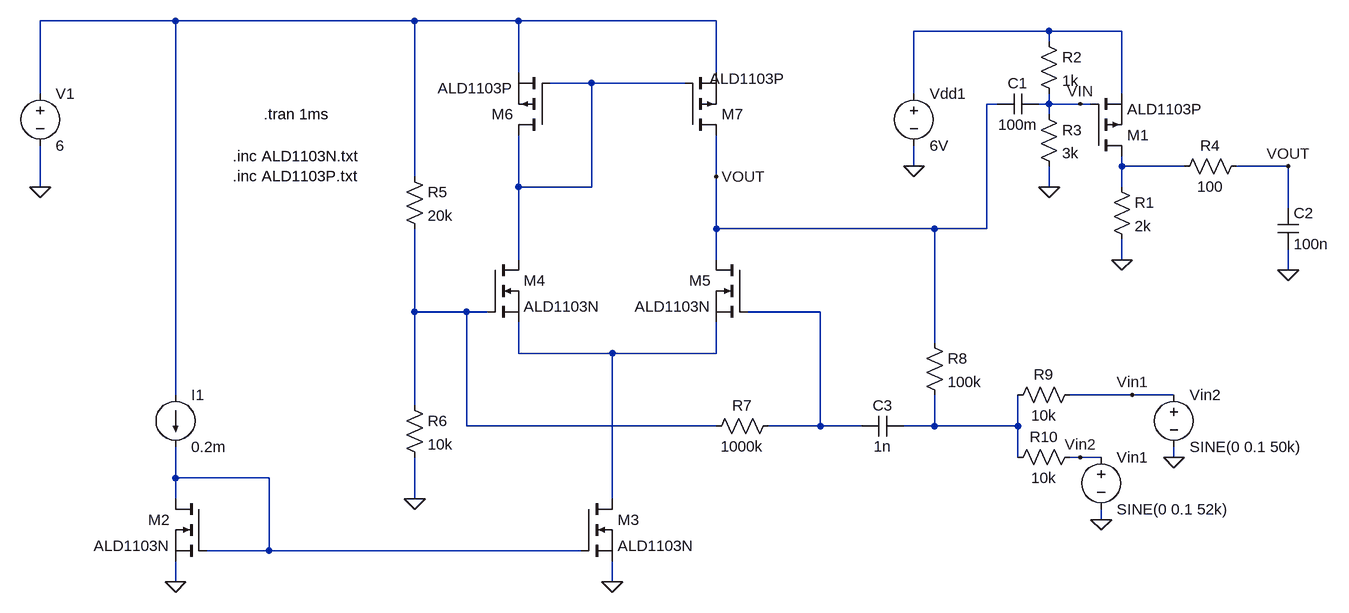
[diagram p0: schematic Draft4.asc]
Draft4.asc, the LTspice schematic file:
Version 4.1
SHEET 1 880 756
WIRE -1200 -128 -1408 -128
WIRE -832 -128 -1200 -128
WIRE -672 -128 -832 -128
WIRE -368 -128 -672 -128
WIRE 144 -112 -64 -112
WIRE 256 -112 144 -112
WIRE 144 -96 144 -112
WIRE -672 -48 -672 -128
WIRE -368 -48 -368 -128
WIRE -560 -32 -624 -32
WIRE -416 -32 -560 -32
WIRE -1408 -16 -1408 -128
WIRE -64 -16 -64 -112
WIRE 256 -16 256 -112
WIRE 64 0 48 0
WIRE 144 0 144 -16
WIRE 144 0 128 0
WIRE 192 0 144 0
WIRE 208 0 192 0
WIRE 144 16 144 0
WIRE -64 96 -64 64
WIRE 256 96 256 80
WIRE 352 96 256 96
WIRE 512 96 432 96
WIRE -832 112 -832 -128
WIRE -368 112 -368 48
WIRE -1408 128 -1408 64
WIRE -672 128 -672 48
WIRE -560 128 -560 -32
WIRE -560 128 -672 128
WIRE 144 128 144 96
WIRE 256 128 256 96
WIRE 512 160 512 96
WIRE -368 192 -368 112
WIRE -32 192 -368 192
WIRE 48 192 48 0
WIRE 48 192 -32 192
WIRE -672 240 -672 128
WIRE -368 240 -368 192
WIRE 256 240 256 208
WIRE 512 256 512 224
WIRE -832 320 -832 192
WIRE -752 320 -832 320
WIRE -720 320 -752 320
WIRE -208 320 -320 320
WIRE -32 368 -32 192
WIRE -672 384 -672 336
WIRE -528 384 -672 384
WIRE -368 384 -368 336
WIRE -368 384 -528 384
WIRE -1200 448 -1200 -128
WIRE 272 448 176 448
WIRE 336 448 272 448
WIRE -832 464 -832 320
WIRE -752 496 -752 320
WIRE -368 496 -752 496
WIRE -208 496 -208 320
WIRE -208 496 -288 496
WIRE -144 496 -208 496
WIRE -32 496 -32 448
WIRE -32 496 -80 496
WIRE 96 496 96 448
WIRE 96 496 -32 496
WIRE 96 544 96 496
WIRE 192 544 176 544
WIRE 224 544 192 544
WIRE 336 544 336 528
WIRE -1200 576 -1200 528
WIRE -1056 576 -1200 576
WIRE -1200 608 -1200 576
WIRE -832 608 -832 544
WIRE -528 608 -528 384
WIRE 224 640 224 624
WIRE -1056 688 -1056 576
WIRE -1056 688 -1152 688
WIRE -576 688 -1056 688
WIRE -1200 736 -1200 704
WIRE -528 736 -528 704
FLAG -64 96 0
FLAG 256 240 0
FLAG 144 128 0
FLAG 192 0 VIN
FLAG 512 256 0
FLAG 512 96 VOUT
FLAG -1200 736 0
FLAG -528 736 0
FLAG -1408 128 0
FLAG -832 608 0
FLAG -368 112 VOUT
FLAG 224 640 0
FLAG 336 544 0
FLAG 272 448 Vin1
FLAG 192 544 Vin2
SYMBOL pmos 208 80 M180
SYMATTR InstName M1
SYMATTR Value ALD1103P
SYMBOL voltage -64 -32 R0
WINDOW 123 0 0 Left 0
WINDOW 39 0 0 Left 0
SYMATTR InstName Vdd1
SYMATTR Value 6V
SYMBOL res 240 112 R0
SYMATTR InstName R1
SYMATTR Value 2k
SYMBOL res 128 -112 R0
SYMATTR InstName R2
SYMATTR Value 1k
SYMBOL res 128 0 R0
SYMATTR InstName R3
SYMATTR Value 3k
SYMBOL cap 128 -16 R90
WINDOW 0 0 32 VBottom 2
WINDOW 3 32 32 VTop 2
SYMATTR InstName C1
SYMATTR Value 100m
SYMBOL res 448 80 R90
WINDOW 0 0 56 VBottom 2
WINDOW 3 32 56 VTop 2
SYMATTR InstName R4
SYMATTR Value 100
SYMBOL cap 496 160 R0
SYMATTR InstName C2
SYMATTR Value 100n
SYMBOL nmos -1152 608 M0
SYMATTR InstName M2
SYMATTR Value ALD1103N
SYMBOL nmos -576 608 R0
SYMATTR InstName M3
SYMATTR Value ALD1103N
SYMBOL nmos -720 240 R0
SYMATTR InstName M4
SYMATTR Value ALD1103N
SYMBOL nmos -320 240 M0
SYMATTR InstName M5
SYMATTR Value ALD1103N
SYMBOL pmos -624 48 R180
SYMATTR InstName M6
SYMATTR Value ALD1103P
SYMBOL pmos -416 48 M180
WINDOW 3 38 87 Left 2
SYMATTR Value ALD1103P
SYMATTR InstName M7
SYMBOL current -1200 448 R0
WINDOW 123 0 0 Left 0
WINDOW 39 0 0 Left 0
SYMATTR InstName I1
SYMATTR Value 0.2m
SYMBOL voltage -1408 -32 R0
WINDOW 123 0 0 Left 0
WINDOW 39 0 0 Left 0
SYMATTR InstName V1
SYMATTR Value 6
SYMBOL res -848 96 R0
SYMATTR InstName R5
SYMATTR Value 20k
SYMBOL res -848 448 R0
SYMATTR InstName R6
SYMATTR Value 10k
SYMBOL res -272 480 R90
WINDOW 0 0 56 VBottom 2
WINDOW 3 32 56 VTop 2
SYMATTR InstName R7
SYMATTR Value 1000k
SYMBOL cap -80 480 R90
WINDOW 0 0 32 VBottom 2
WINDOW 3 32 32 VTop 2
SYMATTR InstName C3
SYMATTR Value 1n
SYMBOL res -48 352 R0
SYMATTR InstName R8
SYMATTR Value 100k
SYMBOL res 192 432 R90
WINDOW 0 0 56 VBottom 2
WINDOW 3 32 56 VTop 2
SYMATTR InstName R9
SYMATTR Value 10k
SYMBOL res 192 528 R90
WINDOW 0 0 56 VBottom 2
WINDOW 3 32 56 VTop 2
SYMATTR InstName R10
SYMATTR Value 10k
SYMBOL voltage 224 528 R0
WINDOW 123 0 0 Left 0
WINDOW 39 0 0 Left 0
SYMATTR InstName Vin1
SYMATTR Value SINE(0 0.1 52k)
SYMBOL voltage 336 432 R0
WINDOW 123 0 0 Left 0
WINDOW 39 0 0 Left 0
SYMATTR InstName Vin2
SYMATTR Value SINE(0 0.1 50k)
TEXT -1112 80 Left 2 !.inc ALD1103N.txt\n.inc ALD1103P.txt
TEXT -1064 16 Left 2 !.tran 1ms

The netlist it stands for:
* Draft4.asc
M1 N004 VIN N002 N002 ALD1103P
Vdd1 N002 0 6V
R1 N004 0 2k
R2 N002 VIN 1k
R3 VIN 0 3k
C1 VIN VOUT 100m
R4 VOUT N004 100
C2 VOUT 0 100n
M2 N009 N009 0 0 ALD1103N
M3 N007 N009 0 0 ALD1103N
M4 N003 N005 N007 N007 ALD1103N
M5 VOUT N006 N007 N007 ALD1103N
M6 N003 N003 N001 N001 ALD1103P
M7 VOUT N003 N001 N001 ALD1103P
I1 N001 N009 0.2m
V1 N001 0 6
R5 N001 N005 20k
R6 N005 0 10k
R7 N006 N005 1000k
C3 N008 N006 1n
R8 VOUT N008 100k
R9 Vin1 N008 10k
R10 Vin2 N008 10k
Vin1 Vin2 0 SINE(0 0.1 52k)
Vin2 Vin1 0 SINE(0 0.1 50k)
.model NMOS NMOS
.model PMOS PMOS
.lib standard.mos
.inc ALD1103N.txt
.inc ALD1103P.txt
.tran 1ms
.backanno
.end